# EAGLE schematic PowerShield (EAGLE 6.5.0)
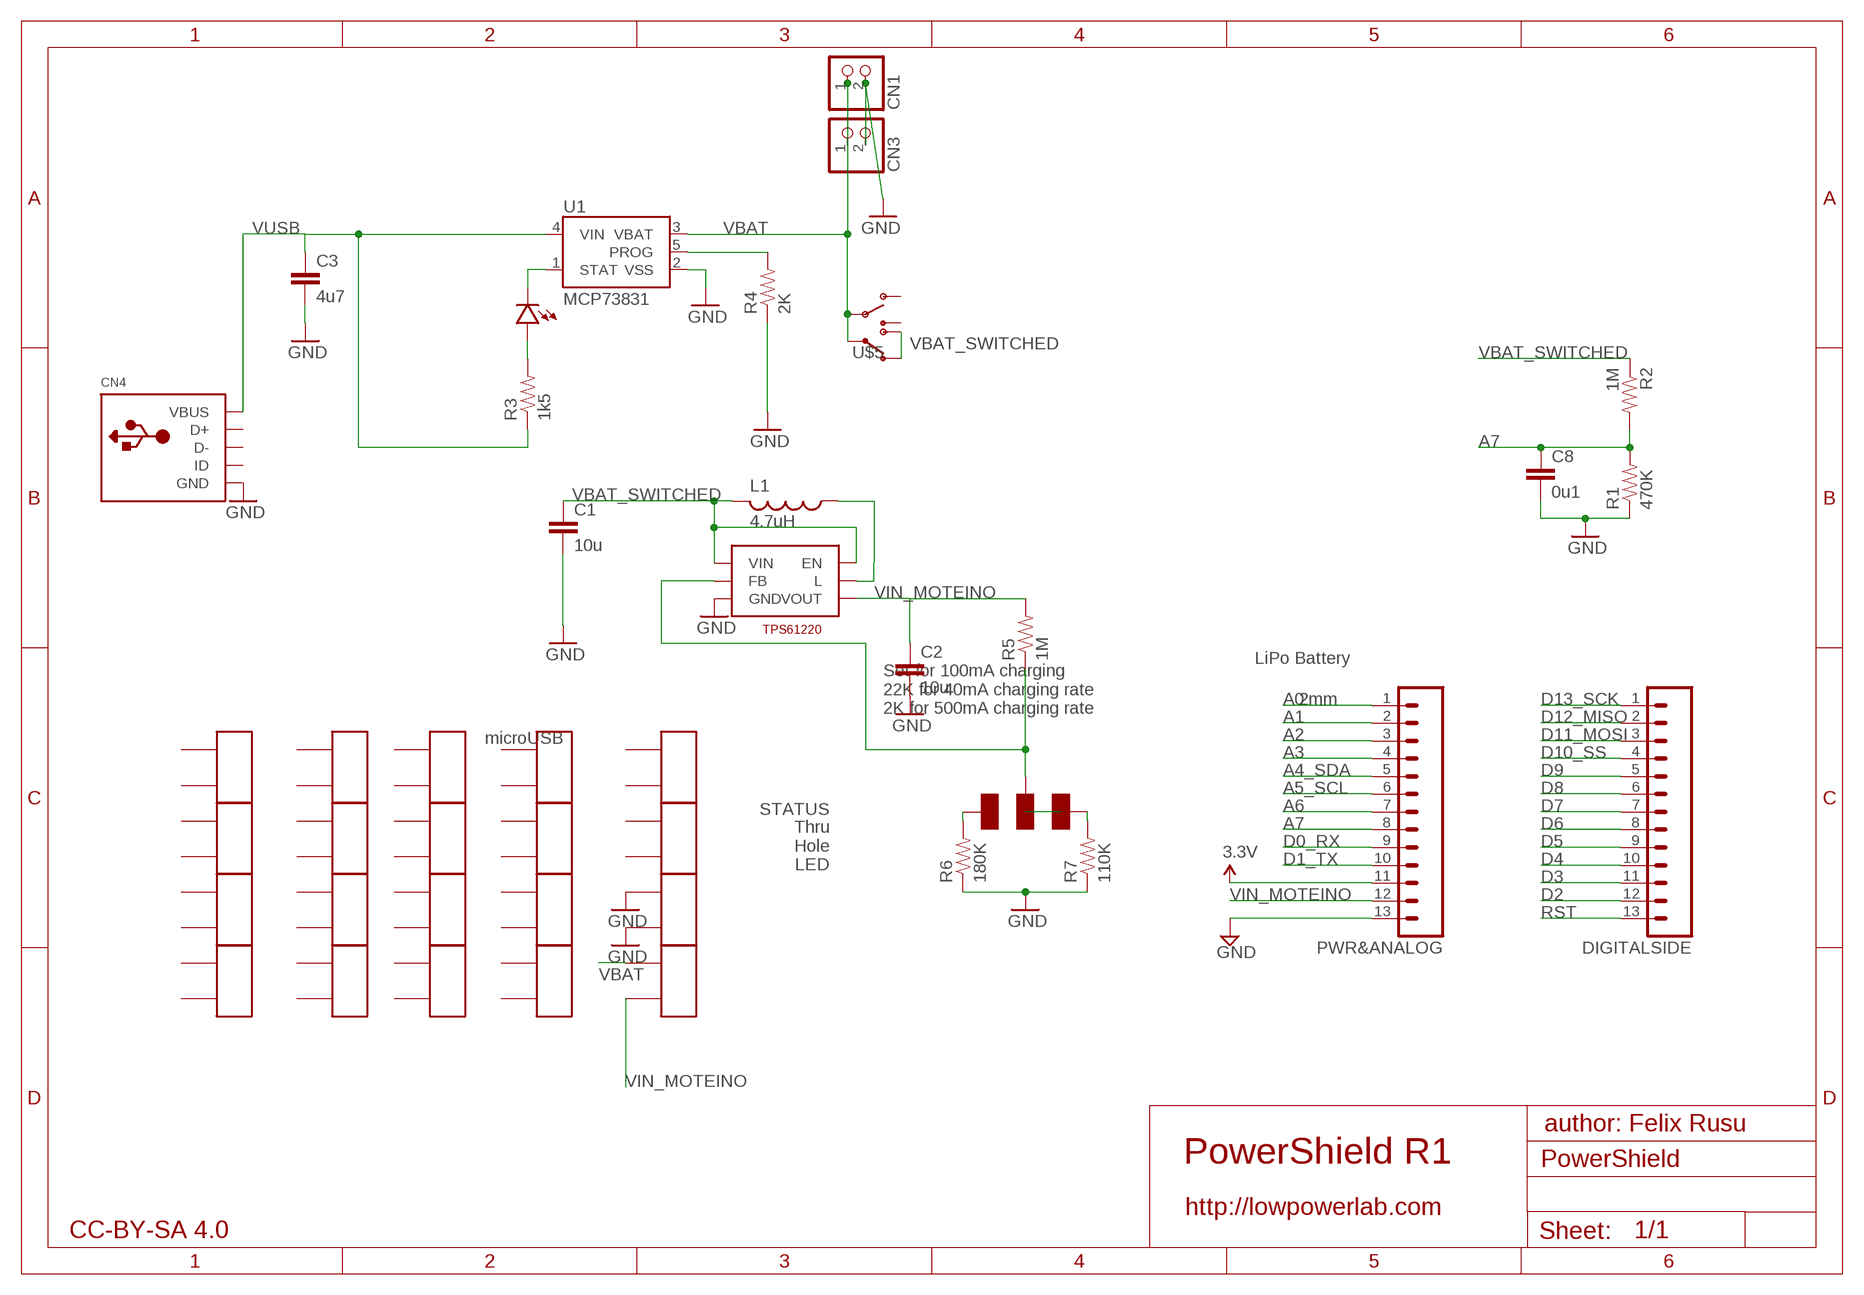
[diagram p0: schematic, sheet 1]

## Parts
C1  10u  CAP0805-CAP-LARGEPADS  [0805-CAP-LARGEPADS]
C2  10u  CAP0805-CAP-LARGEPADS  [0805-CAP-LARGEPADS]
C3  4u7  CAP0603-CAP  [0603-CAP]
C8  0u1  CAP0603-CAP  [0603-CAP]
CN1  JST_2PIN-THM-RA  [JST-PH-2-THM-RA]
CN3  JST_2PIN-SMT-RA  [JST-PH-2-SMT-RA]
CN4  USBMINIB  [USB-MINIB]
DIGITALSIDE  HDR_13PINREGULAR  [1X13]
L1  4.7uH  INDUCTOR_NR3015  [INDUCTOR_NR3015]
PWR&ANALOG  HDR_13PINREGULAR  [1X13]
R1  470K  RESISTOR0603-RES  [0603-RES]
R2  1M  RESISTOR0603-RES  [0603-RES]
R3  1k5  RESISTOR0603-RES  [0603-RES]
R4  2K  RESISTOR0603-RES  [0603-RES]
R5  1M  RESISTOR0603-RES  [0603-RES]
R6  180K  RESISTOR0603-RES  [0603-RES]
R7  110K  RESISTOR0603-RES  [0603-RES]
U1  MCP73831  [SOT23-5]
U$1  SWITCH_SPDT  [SWITCH-SPDT]
U$2  TPS61222SOT363  [SOT363]
U$4  LED0603  [0603-LED]
U$5  SWITCH_SPDT  [KPS-1290]
U$6  HDR_2PIN  [1X02_NS]
U$7  HDR_2PIN  [1X02_NS]
U$8  HDR_2PIN  [1X02_NS]
U$9  HDR_2PIN  [1X02_NS]
U$10  HDR_2PIN  [1X02_NS]
U$11  HDR_2PIN  [1X02_NS]
U$12  HDR_2PIN  [1X02_NS]
U$13  HDR_2PIN  [1X02_NS]
U$14  HDR_2PIN  [1X02_NS]
U$15  HDR_2PIN  [1X02_NS]
U$16  HDR_2PIN  [1X02_NS]
U$17  HDR_2PIN  [1X02_NS]
U$18  HDR_2PIN  [1X02_NS]
U$19  HDR_2PIN  [1X02_NS]
U$20  HDR_2PIN  [1X02_NS]
U$21  HDR_2PIN  [1X02_NS]
U$22  HDR_2PIN  [1X02_NS]
U$23  HDR_2PIN  [1X02_NS]
U$24  HDR_2PIN  [1X02_NS]
U$25  HDR_2PIN  [1X02_NS]
U$26  JUMPER_3  [JUMPER_3]

## Nets
A0: PWR&ANALOG.1
A1: PWR&ANALOG.2
A2: PWR&ANALOG.3
A3: PWR&ANALOG.4
A4_SDA: PWR&ANALOG.5
A5_SCL: PWR&ANALOG.6
A6: PWR&ANALOG.7
A7: C8.1 PWR&ANALOG.8 R1.2 R2.2
D0_RX: PWR&ANALOG.9
D1_TX: PWR&ANALOG.10
D2: DIGITALSIDE.12
D3: DIGITALSIDE.11
D4: DIGITALSIDE.10
D5: DIGITALSIDE.9
D6: DIGITALSIDE.8
D7: DIGITALSIDE.7
D8: DIGITALSIDE.6
D9: DIGITALSIDE.5
D10_SS: DIGITALSIDE.4
D11_MOSI: DIGITALSIDE.3
D12_MISO: DIGITALSIDE.2
D13_SCK: DIGITALSIDE.1
GND [power]: C1.2 C2.2 C3.2 C8.2 CN1.2 CN3.2 CN4.GND PWR&ANALOG.13 R1.1 R4.1 R6.1 R7.1 U1.2(VSS) U$2.3(GND) U$24.1 U$24.2
N$1: L1.P$1 U$2.5(L)
N$3: R3.2 U$4.PLUS
N$4: R6.2 U$26.3
N$5: R7.2 U$26.1
N$7: R5.1 U$2.2(FB) U$26.2
PROG: R4.2 U1.5(PROG)
RST: DIGITALSIDE.13
STAT: U1.1(STAT) U$4.MINUS
VBAT: CN1.1 CN3.1 U1.3(VBAT) U$1.2 U$5.P U$25.1
VBAT_SWITCHED [power]: C1.1 L1.P$2 R2.1 U$1.1 U$2.1(VIN) U$2.6(EN) U$5.S
VCC: PWR&ANALOG.11 ; supply symbol labelled 3.3V
VIN_MOTEINO [power]: C2.1 PWR&ANALOG.12 R5.2 U$2.4(VOUT) U$25.2
VUSB: C3.1 CN4.VBUS R3.1 U1.4(VIN)
Unconnected: CN4.D+ CN4.D- CN4.ID U$1.3 U$5.O U$6.1 U$6.2 U$7.1 U$7.2 U$8.1 U$8.2 U$9.1 U$9.2 U$10.1 U$10.2 U$11.1 U$11.2 U$12.1 U$12.2 U$13.1 U$13.2 U$14.1 U$14.2 U$15.1 U$15.2 U$16.1 U$16.2 U$17.1 U$17.2 U$18.1 U$18.2 U$19.1 U$19.2 U$20.1 U$20.2 U$21.1 U$21.2 U$22.1 U$22.2 U$23.1 U$23.2

## Notes on the sheet
- TPS61220
- LiPo Battery
- 2mm
- Set for 100mA charging
  22K for 40mA charging rate
  2K for 500mA charging rate
- microUSB
- STATUS
- Thru
  Hole
  LED
- author: Felix Rusu
- PowerShield R1
- http://lowpowerlab.com
- CC-BY-SA 4.0

## Library data of the parts
C1 C2 C8 = LowPowerLab:CAP: Capacitor Standard 0603 ceramic capacitor, and 0.1" leaded capacitor.
C3 = SparkFun:CAP: Capacitor Standard 0603 ceramic capacitor, and 0.1" leaded capacitor.
CN1 CN3 = adafruit:JST_2PIN: JST 2-Pin Connectors of various flavors SMT-RA (S2B-PH-SM4) 4UConnector #17311 SMT (B2B-PH-SM4) THM-RA (S2B-PH) THM (B2B-PH)
CN4 = LowPowerLab:USB: USB Connectors USBMINIB - Surface Mount Female Mini-B USB Connector 4UConnector: 06564 By microbuilder.eu Thru-hole RA Female Mini-B USB Connector 4UConnector: 18732 By ladyada.net
DIGITALSIDE PWR&ANALOG = LowPowerLab:HDR_13PIN
L1 = LowPowerLab:INDUCTOR
R1-R7 = LowPowerLab:RESISTOR: Resistor Basic schematic elements and footprints for 0603, 1206, and PTH resistors.
U1 = SparkFun:MCP73831: Microchip's MCP73831 Miniature single cell, fully integrated Li-Ion, Li-polymer charge management controller http://ww1.microchip.com/downloads/en/DeviceDoc/21984a.pdf
U$1 = LowPowerLab:SWITCH_SPDT
U$2 = LowPowerLab:TPS61222
U$4 = LowPowerLab:LED
U$5 = SparkFun-Electromechanical:SWITCH_SPDT: Side-actuated SPDT slide switch, as used on the Arduino Pro
U$6-U$25 = LowPowerLab:HDR_2PIN
U$26 = LowPowerLab:JUMPER_3

## Net classes
1 power: width 0.381 mm, clearance 0.254 mm